# Altium schematic sheet 531_RS26.SchDoc
size A4; SheetNumber: 14; SheetTotal: 20
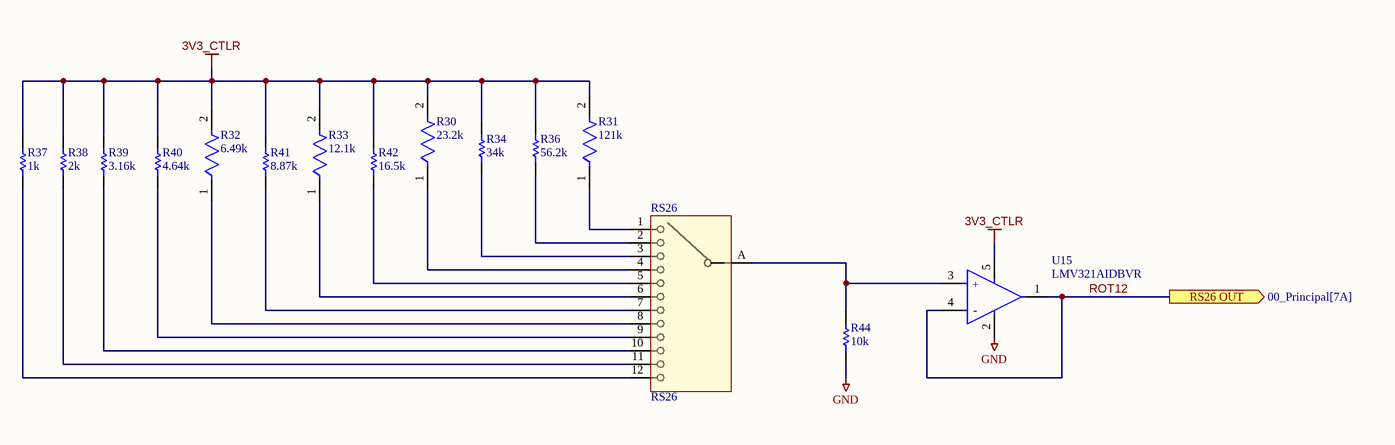
[diagram p0: 531_RS26.SchDoc]

## Parts
R30  23.2k  [FP-ERJ2R-MFG]
R31  121k  [FP-ERJ2R-MFG]
R32  6.49k  [FP-ERJ2RK-MFG]
R33  12.1k  [FP-ERJ2RK-IPC_C]
R34  34k  [RESC1005X40X25LL05T05]
R36  56.2k  [RESC1005X40X25LL05T05]
R37  1k  [RESC1005X40X25NL05T05]
R38  2k  [RESC1005X40X25LL10T10]
R39  3.16k  [RESC1005X40X25ML05T05]
R40  4.64k  [RESC1005X40X25LL05T05]
R41  8.87k  [RESC1005X40X25NL05T05]
R42  16.5k  [RESC1005X40X25LL05T05]
R44  10k  [RESC1005X40X25ML05T05]
RS26  RS26  [RS26]
U15  LMV321AIDBVR  [FP-DBV0005A-MFG]

## Ports
RS26 OUT (out, see 00_Principal[7A])

## Nets
3V3_CTLR: R30.2 R31.2 R32.2 R33.2 R34.2 R36.2 R37.2 R38.2 R39.2 R40.2 R41.2 R42.2 U15.5(V+)
GND: R44.1 U15.2(V-)
ROT12: U15.1(OUT) U15.4(-IN) ; port RS26 OUT
NetR30_1: R30.1 RS26.4(A)
NetR31_1: R31.1 RS26.1(A)
NetR32_1: R32.1 RS26.8(A)
NetR33_1: R33.1 RS26.6(A)
NetR34_1: R34.1 RS26.3(A)
NetR36_1: R36.1 RS26.2(A)
NetR37_1: R37.1 RS26.12(A)
NetR38_1: R38.1 RS26.11(A)
NetR39_1: R39.1 RS26.10(A)
NetR40_1: R40.1 RS26.9(A)
NetR41_1: R41.1 RS26.7(A)
NetR42_1: R42.1 RS26.5(A)
NetR44_2: R44.2 RS26.A U15.3(+IN)

## Notes on the sheet
- (in symbol CMP-04895-000333-1) +; -

## Library data of the parts
R30 = CMP-1011-00662-3: RES SMD 23.2K OHM 1% 1/10W 0402; Manufacturer Part Number: ERJ-2RKF2322X; Manufacturer: Panasonic; Voltage Rating: 50V; Power Rating: 0.1W; Resistance: 23.2kΩ; Temperature Coefficient: 100%; Automotive Grade: Grade 0; Value: 23.2kΩ; Package: ERJ2R; Device Class L2: Resistors; Height: 0.4mm; Temperature Range High: +155°C; Device Class L1: Passive Components; Temperature Range Low: -55°C; Device Class L3: Chip SMD Resistors; ComponentLink2Description: Datasheet; Temperature: -55°C to +155°C; Footprint Url: https://industrial.panasonic.com/cdbs/www-data/pdf/RDA0000/DMA0000COL17.pdf; Category: Res; Automotive: Yes; ComponentLink2URL: https://industrial.panasonic.com/cdbs/www-data/pdf/RDA0000/AOA0000C304.pdf; Digikey Description: RES SMD 23.2K OHM 1% 1/10W 0402; Ipc Land Pattern Name: RESC10050X35; Tolerance: 1%; Lead Free: Yes; RoHS: TRUE; Octopart: https://octopart.com/erj-2rkf2322x-panasonic-55421023; Mouser Description: Thick Film Resistors - SMD 0402 23.2Kohms 1% AEC-Q200; Series: ERJ; Composition: Thick Film
R31 = CMP-2002-00650-2: RES SMD 121K OHM 1% 1/10W 0402; Manufacturer: Panasonic; Manufacturer Part Number: ERJ-2RKF1213X; Voltage Rating: 50V; Power Rating: 0.1W; Value: 121kΩ; Automotive Grade: Grade 0; Temperature Coefficient: 100ppm/°C; Temperature: -55°C to +155°C; Footprint Url: https://industrial.panasonic.com/cdbs/www-data/pdf/RDA0000/DMA0000COL17.pdf; RoHS: TRUE; Ipc Land Pattern Name: RESC10050X35; Automotive: Yes; ComponentLink2Description: Datasheet; Temperature Range Low: -55°C; Octopart: https://octopart.com/erj-2rkf1213x-panasonic-55420883; Category: Res; Package: ERJ2R; Mouser Description: Thick Film Resistors - SMD 0402 121Kohms 1% Tol; Device Class L2: Resistors; Device Class L3: Chip SMD Resistors; Height: 0.4mm; Device Class L1: Passive Components; Tolerance: 1%; Series: ERJ; Digikey Description: RES SMD 121K OHM 1% 1/10W 0402; Temperature Range High: +155°C; Lead Free: Yes; Composition: Thick Film; ComponentLink2URL: https://industrial.panasonic.com/cdbs/www-data/pdf/RDA0000/AOA0000C304.pdf; Resistance: 121kΩ
R32 = CMP-2002-01028-2: NexarPartId: 55421257; Max Power Dissipation: 100mW; Resistance: 6.49kΩ; Voltage Rating: 50V; Tolerance: 1%; Temperature Coefficient: 100ppm/°C; RoHS: Compliant; Number of Terminations: 2; Case Code (Metric): 1005; Schedule B: 8533210045, 8533210045; Composition: Thick Film; Lead Free: Lead Free; Length: 1mm; Voltage Rating (DC): 50V; Max Operating Temperature: 155°C; Width: 508µm; Case Code (Imperial): 0402; REACH SVHC: No SVHC; Depth: 500µm; Contact Plating: Tin; Power Rating: 100mW; Military Standard: Not; Termination: SMD/SMT; Case/Package: 0402; Min Operating Temperature: -55°C; Packaging: Cut Tape; Height: 406.4µm; Lifecycle Status: Production; Mount: Surface Mount
R33 = CMP-2002-00649-2: RES SMD 12.1K OHM 1% 1/10W 0402; Voltage Rating (DC): 50V; Power Rating: 100mW; Temperature Coefficient: 100ppm/°C; Resistance: 12.1kR; Width: 0.02inch; Military Standard: Not; Resistance Tolerance: 1%; Resistor Type: Thick Film; Voltage Rating: 50V; Case/Package: 0402; Packaging: Tape and Reel; Series: ERJ; Number of Terminations: 2; Case Code (Metric): 1005; Radiation Hardening: No; Min Operating Temperature: -55°C; Construction: Rectangular; Technology: THICK FILM; RoHS Compliant: Yes; Termination: SMD/SMT; Contact Plating: Tin; Max Operating Temperature: 155°C; Max Power Dissipation: 100mW; Tolerance: 1%; Features: Automotive AEC-Q200; Height: 0.35mm; REACH SVHC: No SVHC; Depth: 0.5mm; Case Code (Imperial): 0402; Lead Free: Lead Free; Length: 1mm; Mount: Surface Mount; Package Quantity: 1
R34 = CMP-1011-00682-2: Part Number: ERJ-2RKF3402X; Manufacturer: Panasonic
R36 = CMP-2002-00996-1: Part Number: ERJ-2RKF5622X; Manufacturer: Panasonic
R37 = CMP-1011-00510-4: Chip Resistor, 1 KOhm, +/- 1%, 100 mW, -55 to 155 degC, 0402 (1005 Metric), RoHS, Tape and Reel; PartNumber: ERJ-2RKF1001X; Manufacturer: Basic Passives; Voltage Rating: 50 V; Case\/Package: 0402; Resistance: 1 KOhm; Power Rating: 100 mW; DatasheetVersion: 04/2015; Radiation Hardening: No; Pins: 2; Height: 0.35 mm; RoHSCompliant: true; Case Code (Imperial): 0402; ComponentLink2Description: Datasheet; ComponentLink1Description: Manufacturer URL; PackageReference: 0402; Mount: Surface Mount; Package Quantity: 10000; Tolerance: 1%; ComponentLink1URL: http://www.panasonic.com/; PackageDescription: 2-Pin Surface Mount Device, Body 1 x 0.5 mm; Mounting Technology: Surface Mount; Case Code (Metric): 1005; ComponentLink2URL: http://industrial.panasonic.com/cdbs/www-data/pdf/RDA0000/AOA0000C86.pdf; REACH SVHC: Yes; Packaging: Tape and Reel; Max Operating Temperature: 155 degC; Min Operating Temperature: -55 degC; Width: 0.5 mm; Length: 1 mm
R38 = CMP-2002-05790-1: Manufacturer: Panasonic; Part Number: ERA-2AEB202X
R39 = CMP-2002-00861-1: Manufacturer: Panasonic; Part Number: ERJ-2RKF3161X
R40 = CMP-2002-00951-1: Part Number: ERJ-2RKF4641X; Manufacturer: Panasonic
R41 = CMP-1011-00617-2: Part Number: ERJ-2RKF8871X; Manufacturer: Panasonic
R42 = CMP-2002-00717-1: Part Number: ERJ-2RKF1652X; Manufacturer: Panasonic
R44 = CMP-2002-00601-1: Manufacturer: Panasonic; Part Number: ERJ-2RHD1002X
RS26 = RS26 Rotary Coder: RS26 Rotary Type Band Switch Position Switch
U15 = CMP-04895-000333-1: IC OPAMP GP 1 CIRCUIT SOT23-5; Input Bias Current: 10pA; Output Current per Channel: 40mA; Gain Bandwidth Product: 1MHz; Input Offset Voltage (Vos): 1mV; Number of Channels: 1; Operating Supply Current: 80uA; Slew Rate: 1.7V/µs; Mount: Surface Mount; Min Operating Temperature: -40°C; Packaging: Cut Tape; Case/Package: SOT-23-5; RoHS Compliant: Yes; Max Operating Temperature: 125°C; Number of Circuits: 1